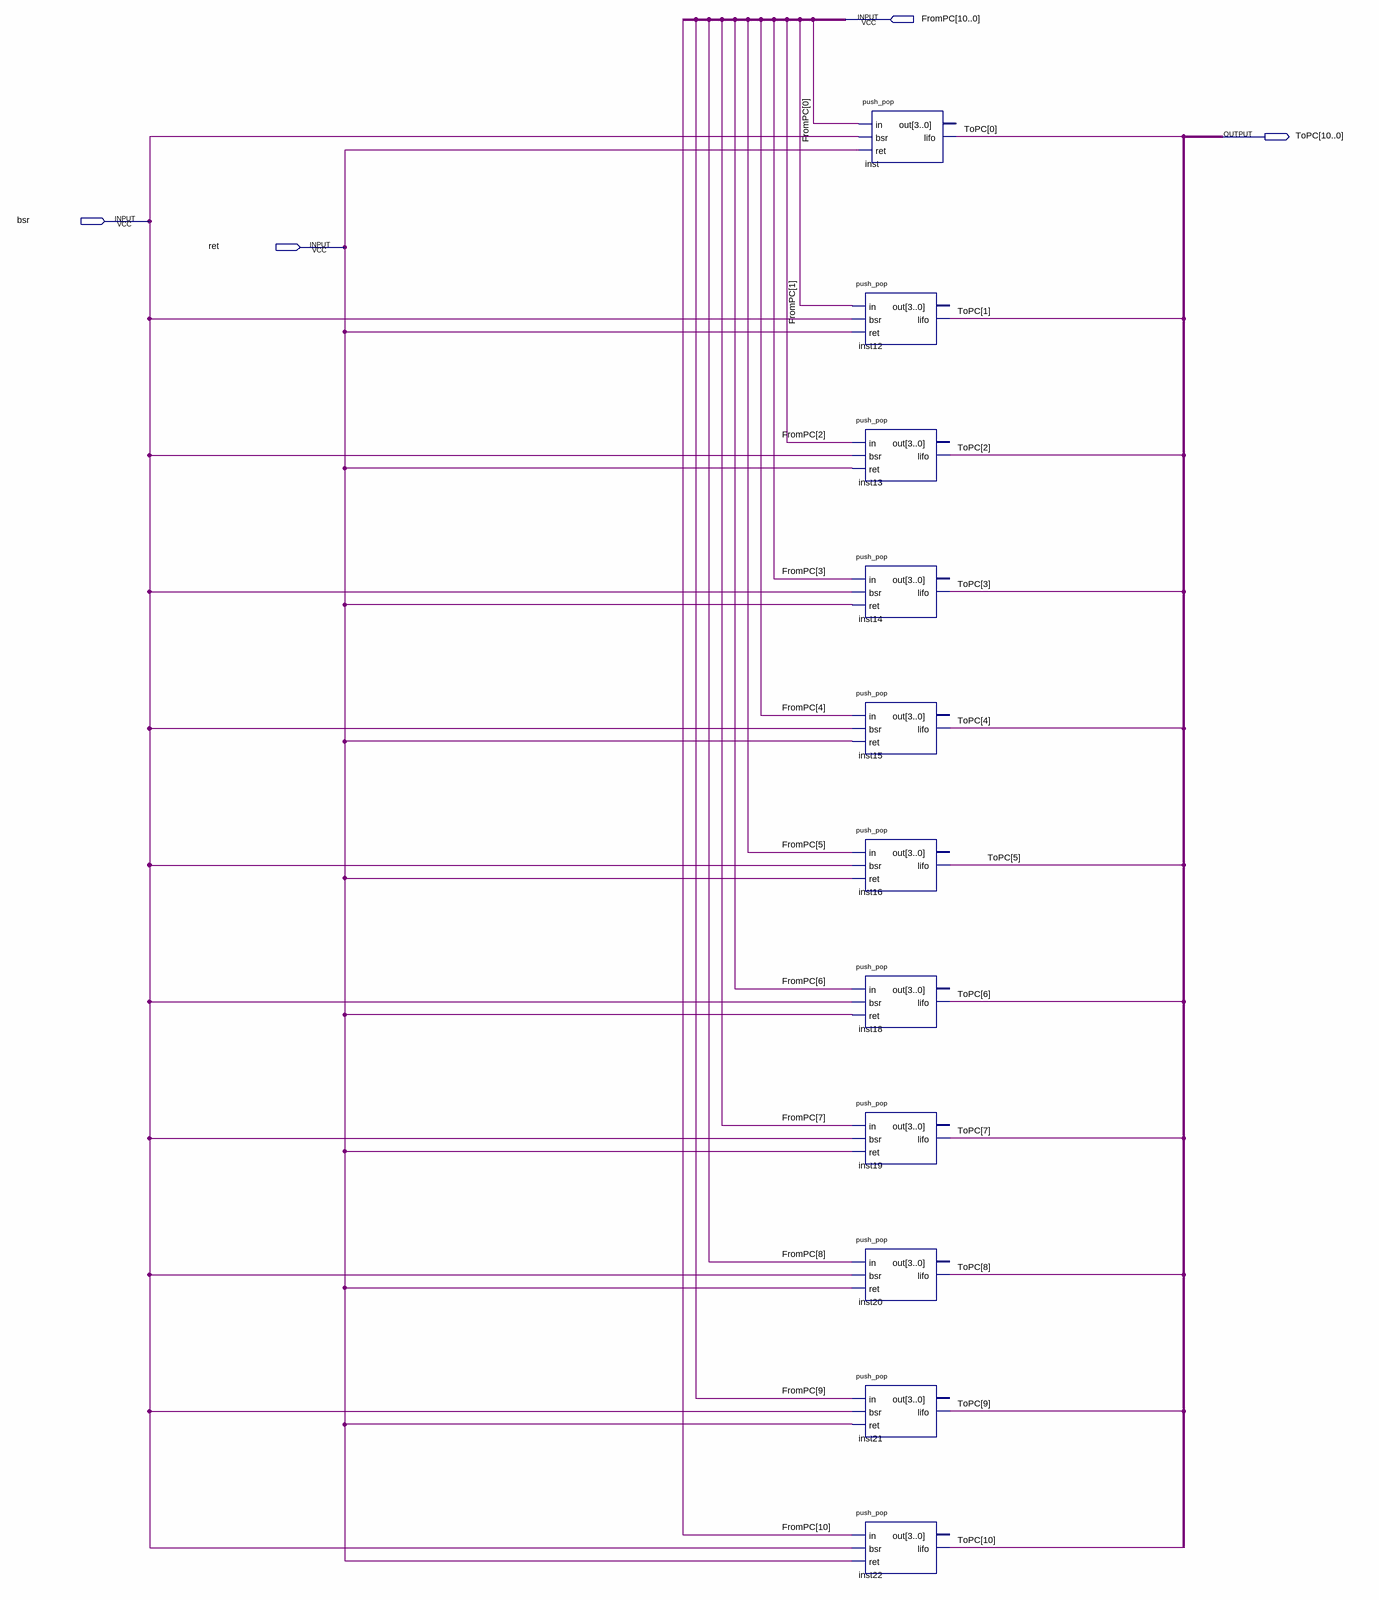
[diagram p0: schematic sheet]
// Quartus schematic stack.bdf as structural Verilog: 11 symbols, 4 pins
module stack (
  input  [10:0] FromPC,
  input  bsr,
  input  ret,
  output [10:0] ToPC
);

  push_pop inst12 (.in(FromPC[1]), .bsr(bsr), .ret(ret), .lifo(ToPC[1]));  // open: out
  push_pop inst13 (.in(FromPC[2]), .bsr(bsr), .ret(ret), .lifo(ToPC[2]));  // open: out
  push_pop inst14 (.in(FromPC[3]), .bsr(bsr), .ret(ret), .lifo(ToPC[3]));  // open: out
  push_pop inst15 (.in(FromPC[4]), .bsr(bsr), .ret(ret), .lifo(ToPC[4]));  // open: out
  push_pop inst16 (.in(FromPC[5]), .bsr(bsr), .ret(ret), .lifo(ToPC[5]));  // open: out
  push_pop inst18 (.in(FromPC[6]), .bsr(bsr), .ret(ret), .lifo(ToPC[6]));  // open: out
  push_pop inst19 (.in(FromPC[7]), .bsr(bsr), .ret(ret), .lifo(ToPC[7]));  // open: out
  push_pop inst20 (.in(FromPC[8]), .bsr(bsr), .ret(ret), .lifo(ToPC[8]));  // open: out
  push_pop inst21 (.in(FromPC[9]), .bsr(bsr), .ret(ret), .lifo(ToPC[9]));  // open: out
  push_pop inst22 (.in(FromPC[10]), .bsr(bsr), .ret(ret), .lifo(ToPC[10]));  // open: out
  push_pop inst (.in(FromPC[0]), .bsr(bsr), .ret(ret), .lifo(ToPC[0]));  // open: out
endmodule
